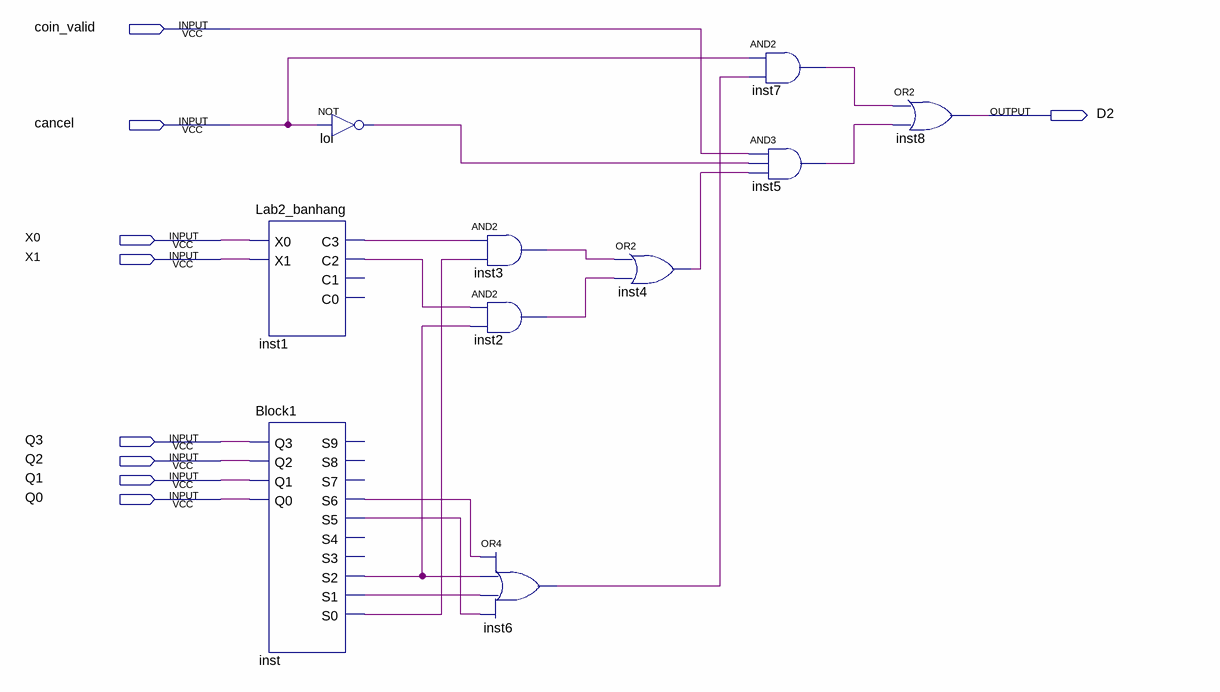
[diagram p0: schematic sheet]
// Quartus schematic block7.bdf as structural Verilog: 10 symbols, 9 pins
module block7 (
  input  coin_valid,
  input  cancel,
  input  X0,
  input  X1,
  input  Q3,
  input  Q2,
  input  Q1,
  input  Q0,
  output D2
);

  wire inst1_c2, inst1_c3, inst2_out, inst3_out, inst4_out, inst5_out, inst6_out, inst7_out, inst_s0,
       inst_s1, inst_s2, inst_s5, inst_s6, lol_out;

  Lab2_banhang inst1 (.X0(X0), .X1(X1), .C3(inst1_c3), .C2(inst1_c2));  // open: C1, C0
  Block1 inst (
    .Q3(Q3), .Q2(Q2), .Q1(Q1), .Q0(Q0), .S6(inst_s6), .S5(inst_s5), .S2(inst_s2), .S1(inst_s1), .S0(inst_s0));  // open: S9, S8, S7, S4, S3
  not lol (lol_out, cancel);
  and inst3 (inst3_out, inst1_c3, inst_s0);
  and inst2 (inst2_out, inst1_c2, inst_s2);
  or inst6 (inst6_out, inst_s6, inst_s2, inst_s1, inst_s5);
  or inst4 (inst4_out, inst3_out, inst2_out);
  and inst7 (inst7_out, cancel, inst6_out);
  and inst5 (inst5_out, coin_valid, lol_out, inst4_out);
  or inst8 (D2, inst7_out, inst5_out);
endmodule
